# Altium project ch340e.PrjPCB
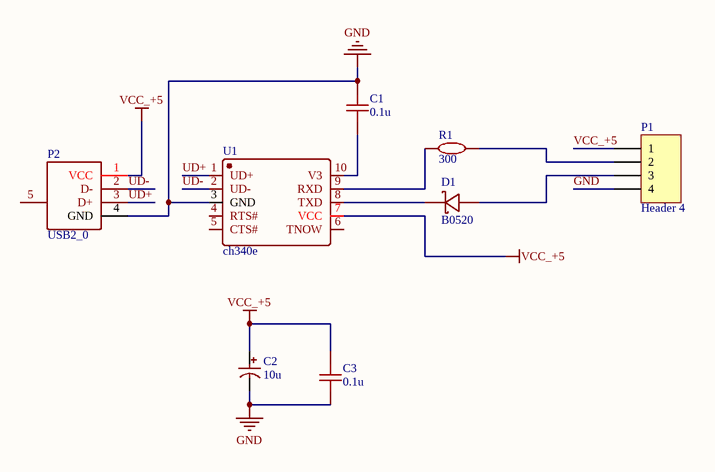
[diagram p0: ch340e.SchDoc]
1 sheet, 8 parts. Net scope: global (net labels, ports and power ports of the same name join across sheets).
Board file: ch340.PcbDoc

## Sheet ch340e.SchDoc
size A4

### Parts
C1  0.1u  [0805_C]
C2  10u  [SMD8x10.2]
C3  0.1u  [0805_C]
D1  B0520  [B0520]
P1  Header 4  [HDR1X4]
P2  USB2_0  [USB2_0]
R1  300  [0805_R]
U1  ch340e  [CH340E]

### Nets
GND: C1.2 C2.2 C3.1 P1.4 P2.4(GND) U1.3(GND)
VCC_+5: C2.1 C3.2 P1.1 P2.1(VCC) U1.7(VCC)
UD+: P2.3(D+) U1.1(UD+)
UD-: P2.2(D-) U1.2(UD-)
NetC1_1: C1.1 U1.10(V3)
NetD1_1: D1.1(C) U1.8(TXD)
NetD1_2: D1.2(A) P1.3
NetP1_2: P1.2 R1.2
NetR1_1: R1.1 U1.9(RXD)

Not connected (* = marked no-connect by the designer): P2 5(SH1); U1 4(RTS#) 5(CTS#) 6(TNOW)

### Library data of the parts
C1 C3 = 0805_C0.1uf
C2 = SMD8x10.2
P1 = Header 4: Header, 4-Pin; LatestRevisionDate: 17-Jul-2002; LatestRevisionNote: Re-released for DXP Platform.; Publisher: Altium Limited
R1 = 0805_R300
U1 = ch340